# Altium schematic sheet Power.SchDoc
size A
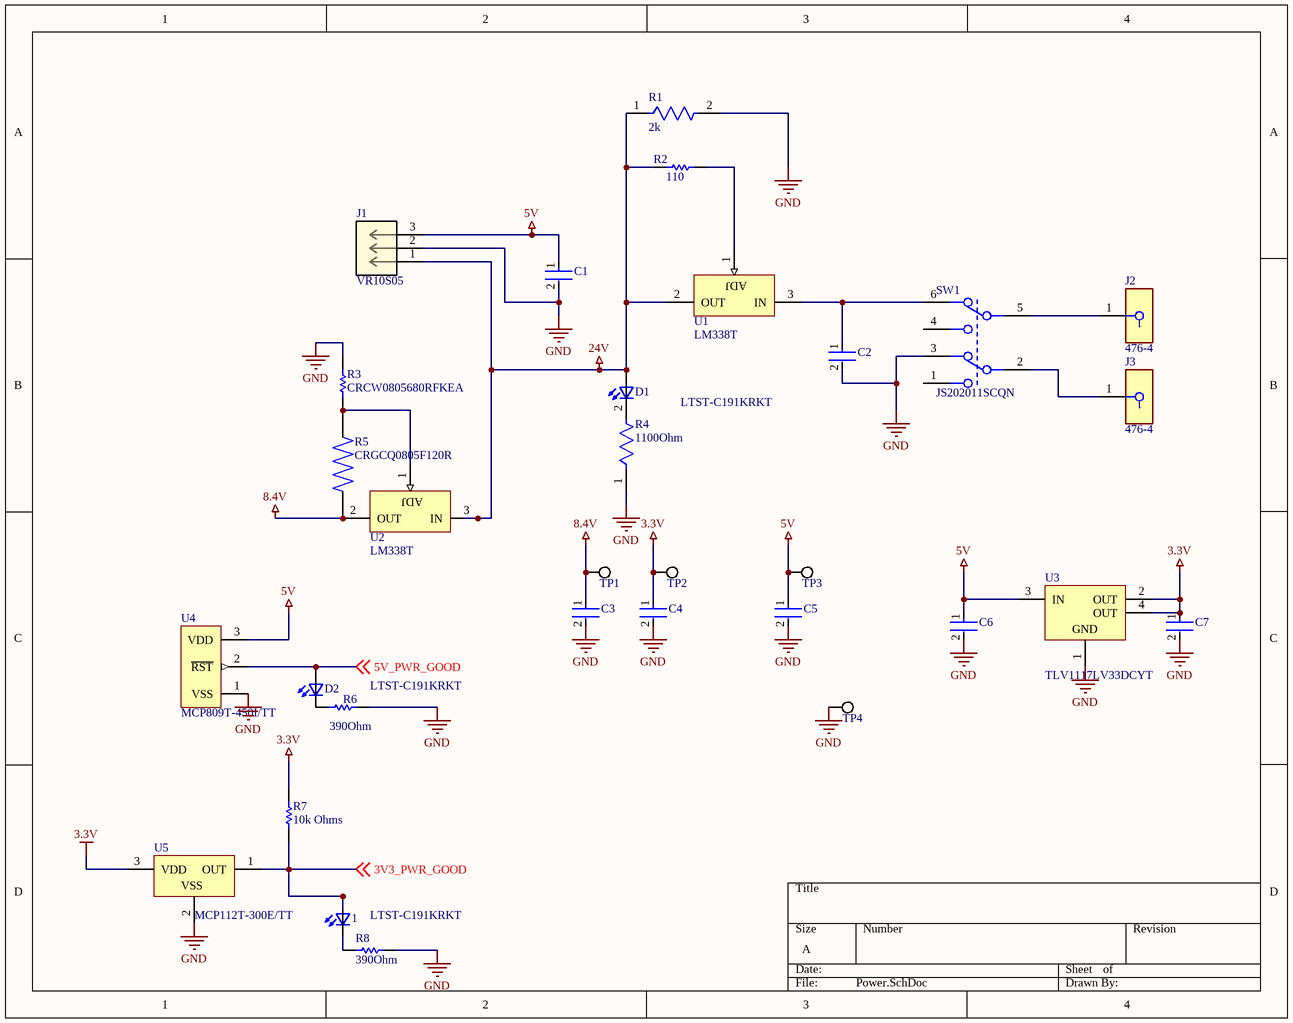
[diagram p0: Power.SchDoc]

## Parts
1  LTST-C191KRKT  [0603]
C1  (no value)  [FP-GRM21B-0_15-MFG]
C2  (no value)  [FP-C0805C-DG-MFG]
C3  (no value)  [FP-C0805C-DG-MFG]
C4  (no value)  [FP-C0805C-DG-MFG]
C5  (no value)  [FP-C0805C-DG-MFG]
C6  (no value)  [FP-C0805C-DG-MFG]
C7  (no value)  [FP-C0805C-DG-MFG]
D1  LTST-C191KRKT  [0603]
D2  LTST-C191KRKT  [0603]
J1  VR10S05  [CONN3_10S05_XPP]
J2  476-4  [FP-476-4-MFG]
J3  476-4  [FP-476-4-MFG]
R1  2k  [FP-CRCW0805-e3-IPC_B]
R2  110  [RESC2013X60X40NL20T25]
R3  CRCW0805680RFKEA  [RESC2013X50X30NL20T20]
R4  1100Ohm  [FP-ESR10-MFG]
R5  CRGCQ0805F120R  [RESC2012X65N]
R6  390Ohm  [RESC3216X70X50LL05T20]
R7  10k Ohms  [RESC2013X60X35ML10T20]
R8  390Ohm  [RESC3216X70X50LL05T20]
SW1  JS202011SCQN  [FP-JS202011SCQN-MFG]
TP1  5019  [KSTN-5019_V]  (value not drawn)
TP2  5019  [KSTN-5019_V]  (value not drawn)
TP3  5019  [KSTN-5019_V]  (value not drawn)
TP4  5019  [KSTN-5019_V]  (value not drawn)
U1  LM338T  [NDE0003A]
U2  LM338T  [NDE0003A]
U3  TLV1117LV33DCYT  [DCY0004A_M]
U4  MCP809T-450I/TT  [SOT-23-TT3_N]
U5  MCP112T-300E/TT  [SOT-23-TT3_L]

## Nets
3.3V: C4.1 C7.1 R7.2 TP2.1 U3.2(OUT) U3.4(OUT) U5.3(VDD)
5V: C1.1 C5.1 C6.1 J1.3 TP3.1 U3.3(IN) U4.3(VDD)
8.4V: C3.1 R5.1 TP1.1 U2.2(OUT)
24V: D1.2(A2) J1.1 R1.1 R2.1 U1.2(OUT) U2.3(IN)
GND: C1.2 C2.2 C3.2 C4.2 C5.2 C6.2 C7.2 J1.2 R1.2 R3.2 R4.1 R6.2 R8.1 SW1.3 TP4.1 U3.1(GND) U4.1(VSS) U5.2(VSS)
3V3_PWR_GOOD: 1.2(A2) R7.1 U5.1(OUT) ; off-sheet 3V3_PWR_GOOD
5V_PWR_GOOD: D2.2(A2) U4.2(~{RST}) ; off-sheet 5V_PWR_GOOD
Net1_1: 1.1(K2) R8.2
NetC2_1: C2.1 SW1.6 U1.3(IN)
NetD2_1: D2.1(K2) R6.1
NetJ2_1: J2.1 SW1.5
NetJ3_1: J3.1 SW1.2
NetR2_2: R2.2 U1.1(ADJ)
NetR3_1: R3.1 R5.2 U2.1(ADJ)

Not connected (* = marked no-connect by the designer): D1 1(K2); R4 2; SW1 1 4

## Library data of the parts
1 D1 D2 = LTST-C191KRKT: http://octopart.com/ltst-c190krkt-lite-on-549893; Package: None; MP: LTST-C191KRKT; Value: *; Availability: Unavailable; Price: None
C1 = CMP-2007-03385-2: 22uF; Manufacturer: Murata; Manufacturer Part Number: GRM21BR60J226ME39L; Material: Ceramic; Voltage: 6.3V; Dielectric: X5R; Tolerance: 20%; Max Operating Temperature: 85°C; Min Operating Temperature: -55°C; Case/Package: 0805; Thickness: 0.053inch; Packaging: Tape and Reel; Depth: 1.25mm; Termination: SMD/SMT; Voltage Rating (DC): 6.3V; Radiation Hardening: No; Mount: Surface Mount; Lead Free: Lead Free; Package Quantity: 1; REACH SVHC: No SVHC; Voltage Rating: 6.3V; Capacitance: 22uF; Length: 2mm; Case Code (Imperial): 0805; Case Code (Metric): 2012; Width: 0.049inch; Height: 1.25mm; Supplier 1: Digi-Key; Supplier Part Number 1: 490-1719-1-ND; RoHS: Yes; Category: Ceramic Capacitors; Stock 1: 2705091; Pricing 1: 1=0.37000, 10=0.25600, 50=0.17940, 100=0.15380, 500=0.11532, 1000=0.09739 (USD); Series: GRM; Construction: Flat; RoHS Compliant: Yes; Reach SVHC Compliant: Yes
C2-C7 = CMP-2007-03243-2: 10uF; Manufacturer Part Number: C0805C106K8PACTU; Manufacturer: Kemet; 3DS Part Number: 220-00001; Tolerance: 10%; Temperature Coefficient: 15%; Material: Ceramic; Voltage: 10V; Temperature Characteristic: X5R; Device Class L2: Capacitors; Device Class L1: Passive Components; ComponentLink2URL: https://content.kemet.com/datasheets/KEM_C1006_X5R_SMD.pdf; Height: 1.4mm; Lead Free: Yes; Digikey Description: CAP CER 10UF 10V X5R 0805; Octopart: https://octopart.com/c0805c106k8pactu-kemet-98697; Capacitance: 10uF; Value: 10uF; Temperature Range Low: -55°C; Temperature: -55°C to +85°C; Automotive: No; Mouser Description: CAP CER 10UF 10V X5R 0805; Ipc Land Pattern Name: CAPC200125X125; Temperature Range High: +85°C; RoHS: TRUE; Device Class L3: Ceramic Capacitors; ComponentLink2Description: Datasheet; Voltage Rating: 10V; Package: C0805C-DG; Category: Cap
J1 = VR10S05: No Description Available; Mfr_Name: XP Power; RefDes: RefDes; Type: Type
J2 J3 = CMP-19636-000003-1: PLUG JACK MINI NON-INSULATED; Manufacturer: Keystone Electronics; Is Female: yes; Number Of Contacts: 1; Current Rating: 10A; Conn Orientation: Straight; Device Class L1: Connectors; Category: Conn; ComponentLink2Description: Datasheet; Lead Free: Yes; Device Class L3: unset; Package: 476-4; RoHS: TRUE; Contact Material: Tin; Footprint Url: https://www.keyelco.com/product-pdf.cfm?p=2378; Mouser Description: Test Plugs & Test Jacks BANANA JACK NON-INSUL; Octopart: https://octopart.com/476-4-keystone-225161; Device Class L2: unset; Manufacturer Part Number: 476-4; ComponentLink2URL: https://www.keyelco.com/userAssets/file/M65p111.pdf; Digikey Description: PLUG JACK MINI NON-INSULATED; Automotive: No
R1 = CMP-2001-03755-2: RES Thick Film, 2kΩ, 1%, 0.125W, 100ppm/°C, 0805; Working Voltage: 150V; Max Power Dissipation: 125mW; Resistance: 2kR; Package Quantity: 10; Case Code (Metric): 2012; Voltage Rating: 150V; Number of Terminations: 2; Max Operating Temperature: 155°C; Depth: 1.25mm; Tolerance: 1%; Power Rating: 125mW; Lead Free: Lead Free; Case/Package: 0805; Features: Automotive AEC-Q200; Min Operating Temperature: -55°C; Termination: SMD/SMT; Case Code (Imperial): 0805; Weight: 0.000194oz; Packaging: Tape and Reel; Military Standard: Not; Radiation Hardening: No; Contact Plating: Tin; Mount: Surface Mount; Temperature Coefficient: 100ppm/°C; Height: 0.02inch; Number of Terminals: 2; Voltage Rating (DC): 150V; Number of Pins: 2; Length: 2mm; Width: 1.25mm; Composition: Thick Film
R2 = CMP-2001-00585-1: Part Number: ERA6AEB111V; Manufacturer: Panasonic
R3 = CMP-2001-04066-1: Manufacturer: Vishay Dale; Part Number: CRCW0805680RFKEA
R4 = CMP-08839-007508-1: 1.1kΩ ±1% 0.4W 0805 Anti-Surge Chip Resistor AEC-Q200; Max Power Dissipation: 400mW; Temperature Coefficient: 100ppm/°C; Resistance: 1.1kR; Size Code: 0805; Case/Package: 0805; Resistor Type: Thick Film; Lead Free: Lead Free; Max Operating Temperature: 155°C; Package Quantity: 1; Power Rating: 400mW; Series: ESR; Number of Terminations: 2; Height: 0.026inch; Features: Automotive AEC-Q200; Case Code (Metric): 2012; Width: 0.049inch; Length: 0.079inch; Tolerance: 1%; Case Code (Imperial): 0805; Packaging: Tape and Reel; RoHS Compliant: Yes; Min Operating Temperature: -55°C
R5 = CRGCQ0805F120R: Fixed Resistor CRGCQ 0805 120R 1%; MF: TE Connectivity; SnapEDA_Link: https://www.snapeda.com/parts/CRGCQ0805F120R/TE%20Connectivity/view-part/3187861/?ref=snap; Availability: Unavailable; TE_purchase_URL: https://www.te.com/usa-en/product-1-2176341-4.html?te_bu=Cor&te_type=disp&te_campaign=seda_glo_cor-seda-global-disp-prtnr-fy19-seda-model-bom-cta_sma-317_1&elqCampaignId=32493; MP: CRGCQ0805F120R; Price: None; Value: *; Package: 2012 TE Connectivity
R6 R8 = CMP-1014-00463-2: Manufacturer: Panasonic; Part Number: ERJ8ENF3900V
R7 = CMP-2000-05025-1: Chip Resistor, 10 KOhm, +/- 5%, 0.125 W, -55 to 155 degC, 0805 (2012 Metric), RoHS, Tape and Reel; Manufacturer: Yageo; Resistor Element Type: ThickFilm; Voltage Rating: 150V; Product Range: RCSeries; SVHC: ToBeAdvised; Resistor Case Style: 0805[2012Metric]; Temperature Coefficient: ±100ppm/degC; Power Rating: 250mW; Resistance: 10kohm; Automotive Qualification Standard: -; Datasheet Version: REV. 2, 09/2004; Packaging: CutTape; Resistance Tolerance: ±5%; MSL: MSL1-Unlimited; Manufacturer URL: http://www.yageo.com/; Datasheet URL: http://www.yageo.ru/pdf/RC0805.pdf; Package Description: 2-Pin Surface Mounted Device, Body 2 x 1.25 mm; Package Reference: 805
SW1 = CMP-2000-05087-3: SWITCH SLIDE DPDT 300MA 6V; Switch Function: On-On; Actuator Type: Standard; Switch Travel: 2mm; Actuator Color: Black; Contact Resistance: 70mR; Electrical Life: 5000Cycles; Actuator Material: Nylon; REACH SVHC: No SVHC; Series: JS; Min Operating Temperature: -20°C; Depth: 7.5mm; Housing Material: Nylon; Voltage Rating (DC): 6V; Max Operating Temperature: 85°C; Contact Current Rating: 300mA; Package Quantity: 1; Contact Plating: Silver; Contact Material: Copper Alloy; Throw Configuration: DPDT; Current Rating: 300mA; Orientation: Vertical; Max Current Rating: 300mA; Max Voltage Rating (DC): 6V; Flammability Rating: UL94 V-2; Length: 9mm; Packaging: Tape and Reel; Mount: Surface Mount; Actuator Length: 2mm; Lead Free: Lead Free; Termination: Gull Wing; Radiation Hardening: No
TP1-TP4 = CMP-1672-00008-1: Test Point, 1 Position SMD, RoHS, Tape and Reel; Manufacturer 1: Keystone Electronics; ComponentLink1Description: Manufacturer URL; Package Quantity: 1000; DatasheetVersion: 03/2014; Packaging: Tape and Reel; ComponentLink2URL: http://www.keyelco.com/product-pdf.cfm?p=1357; ComponentLink1URL: http://www.keyelco.com/; Mount: Surface Mount; Contact Plating: Silver; PackageDescription: 1-Pin Surface Mount Device, Body 3.81 x 2.03 mm; Pins: 1; RoHSCompliant: True; Mounting Technology: Surface Mount; ComponentLink2Description: Datasheet; PackageReference: 5019; Supplier 1: Digi-Key; Supplier Part Number 1: 36-5019CT-ND; Manufacturer Part Number 1: 5019; RoHS: Yes; Category: Connectors; Stock 1: 1316816; Pricing 1: 1=0.34000, 25=0.27360, 100=0.22340, 250=0.20064, 500=0.19152 (USD); Number of Pins: 1; Material: Bronze; Contact Material: Bronze; Series: 5019; Termination: SMD/SMT; Height: 0.09inch; RoHS Compliant: Yes; REACH SVHC: No SVHC; Lead Free: Lead Free; ComponentLink3URL: https://datasheet.ciiva.com/16318/m60-2p61-16318395.pdf?src-supplier=Future+Electronics; ComponentLink3Description: https://datasheet.ciiva.com/16318/m60-2p61-16318395.pdf?src-supplier=Future+Electronics; ComponentLink4URL: https://datasheet.ciiva.com/16885/70182998-16885945.pdf?src-supplier=Allied+Electronics; ComponentLink4Description: https://datasheet.ciiva.com/16885/70182998-16885945.pdf?src-supplier=Allied+Electronics; ComponentLink5URL: https://datasheet.ciiva.com/14848/m60-2p61-14848437.pdf?src-supplier=Digi-Key; ComponentLink5Description: https://datasheet.ciiva.com/14848/m60-2p61-14848437.pdf?src-supplier=Digi-Key; ComponentLink6URL: https://datasheet.ciiva.com/14848/m60-2p61-14848438.pdf?src-supplier=Digi-Key; ComponentLink6Description: https://datasheet.ciiva.com/14848/m60-2p61-14848438.pdf?src-supplier=Digi-Key; ComponentLink7URL: https://datasheet.ciiva.com/14848/m60-2p61-14848439.pdf?src-supplier=Digi-Key; ComponentLink7Description: https://datasheet.ciiva.com/14848/m60-2p61-14848439.pdf?src-supplier=Digi-Key
U1 U2 = CMP-0062-02475-3: 5 Amp Adjustable Regulator, 3-pin TO-220; Manufacturer: Texas Instruments; PowerWise: N; PackageTopMarking: NSUZXYTTE#*LM338T P+; CompType: LDO IC; RoHS: N; PackageDescription: TO-220, Molded, 3 Lead, Straight; PinCount: 3; ComponentLink1URL: http://www.ti.com/general/docs/lit/getliterature.tsp?genericPartNumber=LM338&fileType=pdf; ComponentLink1Description: Datasheet URL; PackageReference: NDE0003A
U3 = CMP-0395-00499-2: Single Output LDO, 1 A, Fixed 3.3 V Output, 2 to 5.5 V Input, 4-pin SOT-223 (DCY), -40 to 125 degC, Green (RoHS & no Sb/Br); Manufacturer: Texas Instruments; Vout Adj(Max)(V): 3.3; Iout(Max)(A): 1; SubFamily: Single Channel LDO; Iq(Typ)(mA): 0.05; Accuracy(%): 2; Vin(Max)(V): 5.5; Vdo(Typ)(mV): 1200; PartNumber: TLV1117LV33DCYT; PackageReference: DCY0004A; PackageVersion: 4202506/B; ComponentLink1URL: http://www.ti.com/; DatasheetVersion: SBVS160A; Mounting Technology: Surface Mount; Fixed Output Options(V): 3.3; ComponentLink3Description: Package Specification; PackageDescription: 4-Pin Plastic Small Outline, Body 3.5 x 6.5 mm, Pitch 2.3 mm; Vout Adj(Min)(V): 3.3; ComponentLink2URL: http://www.ti.com/general/docs/lit/getliterature.tsp?genericPartNumber=TLV1117LV33&fileType=pdf; Code_JEDEC: TO-261; ComponentLink1Description: Manufacturer URL; Vin(Min)(V): 2; ComponentLink2Description: Datasheet; Eco-Plan: Green (RoHS & no Sb/Br); ComponentLink3URL: http://www.ti.com/litv/pdf/mpds094a
U4 = CMP-0138-00383-1: Microcontroller Supervisory Circuit with Push-Pull Output, 3-Pin SOT-23, Industrial Temperature, Tape and Reel; DatasheetVersion: revC, 2001; PackageReference: SOT-23-TT3; Code_IPC: SOT23-3; PackageVersion: revBB, Aug-2009; PackageDescription: 3-Lead Plastic Small Outline Transistor (TT) [SOT-23]
U5 = CMP-0130-00043-1: 1.75Î¼A Micropower Voltage Detector, Push-Pull Output, 2.93V, 3-Pin SOT-23, Extended Temperature, Tape and Reel; Code_IPC: SOT23-3; DatasheetVersion: revD, Jun-2005; PackageVersion: revBB, Aug-2009; PackageDescription: 3-Lead Plastic Small Outline Transistor (TT) [SOT-23]; PackageReference: SOT-23-TT3